# Altium schematic sheet MBoardConnect.SchDoc
size B; SheetNumber: 2; SheetTotal: 4
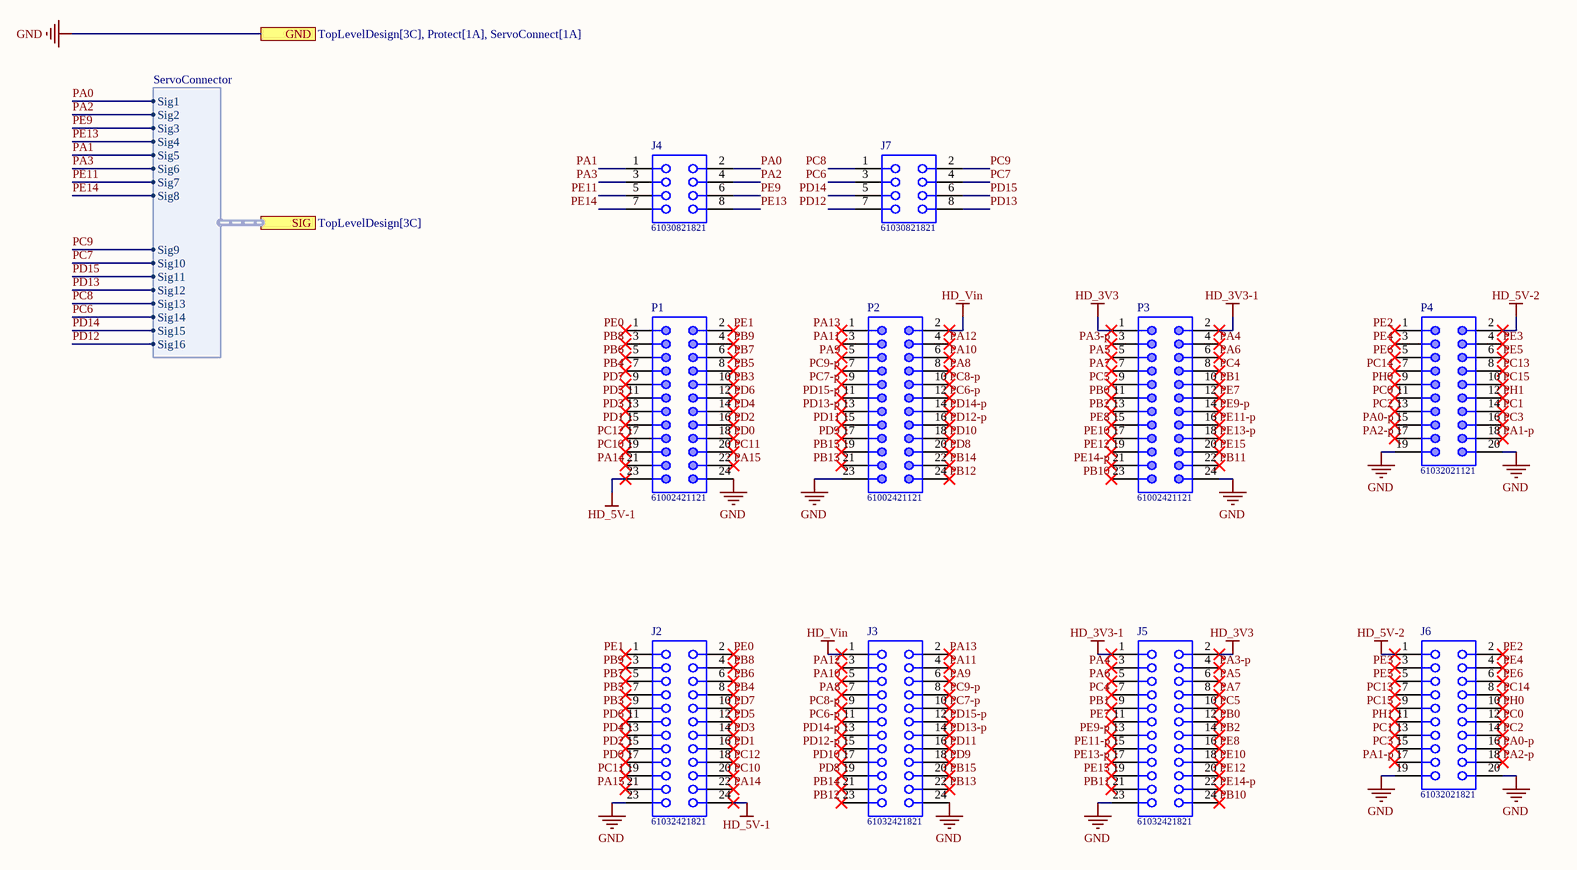
[diagram p0: MBoardConnect.SchDoc]

## Parts
J2  61032421821  [61032421821]
J3  61032421821  [61032421821]
J4  61030821821  [61030821821]
J5  61032421821  [61032421821]
J6  61032021821  [61032021821]
J7  61030821821  [61030821821]
P1  61002421121  [61002421121]
P2  61002421121  [61002421121]
P3  61002421121  [61002421121]
P4  61032021121  [61032021121]

## Ports
GND (see TopLevelDesign[3C], Protect[1A], ServoConnect[1A]), SIG (harness ServoConnector, see TopLevelDesign[3C])

## Harnesses
ServoConnector: Sig1, Sig2, Sig3, Sig4, Sig5, Sig6, Sig7, Sig8, Sig9, Sig10, Sig11, Sig12, Sig13, Sig14, Sig15, Sig16

## Nets
GND: J2.23 J3.24 J5.23 J6.19 J6.20 P1.24 P2.23 P3.24 P4.19 P4.20 ; port GND
HD_3V3: J5.2 P3.1
HD_3V3-1: J5.1 P3.2
HD_5V-1: J2.24 P1.23
HD_5V-2: J6.1 P4.2
HD_Vin: J3.1 P2.2
PA0: J4.2 ; port SIG.Sig1
PA0-p: J6.16 P4.15
PA1: J4.1 ; port SIG.Sig5
PA1-p: J6.17 P4.18
PA2: J4.4 ; port SIG.Sig2
PA2-p: J6.18 P4.17
PA3: J4.3 ; port SIG.Sig6
PA3-p: J5.4 P3.3
PA4: J5.3 P3.4
PA5: J5.6 P3.5
PA6: J5.5 P3.6
PA7: J5.8 P3.7
PA8: J3.7 P2.8
PA9: J3.6 P2.5
PA10: J3.5 P2.6
PA11: J3.4 P2.3
PA12: J3.3 P2.4
PA13: J3.2 P2.1
PA14: J2.22 P1.21
PA15: J2.21 P1.22
PB0: J5.12 P3.11
PB1: J5.9 P3.10
PB2: J5.14 P3.13
PB3: J2.9 P1.10
PB4: J2.8 P1.7
PB5: J2.7 P1.8
PB6: J2.6 P1.5
PB7: J2.5 P1.6
PB8: J2.4 P1.3
PB9: J2.3 P1.4
PB10: J5.24 P3.23
PB11: J5.21 P3.22
PB12: J3.23 P2.24
PB13: J3.22 P2.21
PB14: J3.21 P2.22
PB15: J3.20 P2.19
PC0: J6.12 P4.11
PC1: J6.13 P4.14
PC2: J6.14 P4.13
PC3: J6.15 P4.16
PC4: J5.7 P3.8
PC5: J5.10 P3.9
PC6: J7.3 ; port SIG.Sig14
PC6-p: J3.11 P2.12
PC7: J7.4 ; port SIG.Sig10
PC7-p: J3.10 P2.9
PC8: J7.1 ; port SIG.Sig13
PC8-p: J3.9 P2.10
PC9: J7.2 ; port SIG.Sig9
PC9-p: J3.8 P2.7
PC10: J2.20 P1.19
PC11: J2.19 P1.20
PC12: J2.18 P1.17
PC13: J6.7 P4.8
PC14: J6.8 P4.7
PC15: J6.9 P4.10
PD0: J2.17 P1.18
PD1: J2.16 P1.15
PD2: J2.15 P1.16
PD3: J2.14 P1.13
PD4: J2.13 P1.14
PD5: J2.12 P1.11
PD6: J2.11 P1.12
PD7: J2.10 P1.9
PD8: J3.19 P2.20
PD9: J3.18 P2.17
PD10: J3.17 P2.18
PD11: J3.16 P2.15
PD12: J7.7 ; port SIG.Sig16
PD12-p: J3.15 P2.16
PD13: J7.8 ; port SIG.Sig12
PD13-p: J3.14 P2.13
PD14: J7.5 ; port SIG.Sig15
PD14-p: J3.13 P2.14
PD15: J7.6 ; port SIG.Sig11
PD15-p: J3.12 P2.11
PE0: J2.2 P1.1
PE1: J2.1 P1.2
PE2: J6.2 P4.1
PE3: J6.3 P4.4
PE4: J6.4 P4.3
PE5: J6.5 P4.6
PE6: J6.6 P4.5
PE7: J5.11 P3.12
PE8: J5.16 P3.15
PE9: J4.6 ; port SIG.Sig3
PE9-p: J5.13 P3.14
PE10: J5.18 P3.17
PE11: J4.5 ; port SIG.Sig7
PE11-p: J5.15 P3.16
PE12: J5.20 P3.19
PE13: J4.8 ; port SIG.Sig4
PE13-p: J5.17 P3.18
PE14: J4.7 ; port SIG.Sig8
PE14-p: J5.22 P3.21
PE15: J5.19 P3.20
PH0: J6.10 P4.9
PH1: J6.11 P4.12

## Library data of the parts
J2 J3 J5 = CMP-002-00462-1: WR-PHD Socket Header, SMT, pitch 2.54mm, Dual Row, Vertical, 24p; Manufacturer: Wurth Elektronik; Pin Number: 24; Contact Resistance: 20mOhm; Rated Current: 3A; Working Voltage: 250VAC; Withstanding Voltage: 600VAC; System: Connector; Packaging: Tape and Reel; Supplier 3 Name: thegioiic; Operating Temperature: -40 to +105degC; Pitch: 2.54mm; Row Number: Dual; Orientation: Vertical; ComponentLink2URL: https://www.we-online.com/catalog/datasheet/61032421821.pdf; Mounting Technology: SMT; Component Type: Standard; Supplier 1 URL: https://www.mouser.vn/ProductDetail/Wurth-Elektronik/61032421821?qs=Cb2nCFKsA8olwuXV8WYPMw%3D%3D; Supplier 1 Name: Mouser; Pins: 24; Published Date: May 2020; ComponentLink1Description: Manufacturer; Supplier 2 Name: Digi-Key; Supplier 3 SN: N/A; ComponentLink4Description: Global Supply; ComponentLink2Description: Datasheet; Source: WR-PHD_Socket Header_2.54mm.SchLib; ComponentLink3URL: https://www.we-online.com/en/components/products/PHD_2_54_SMT_DUAL_SOCKET_HEADER_6100XX21821?sq=61032421821#61032421821; ComponentLink1URL: http://www.we-online.de; Supplier 2 URL: N/A; Gender: Socket Header; Manufacturer Part Number: 61032421821; Design Item ID: 61032421821; ComponentLink4URL: https://www.mouser.vn/ProductDetail/Wurth-Elektronik/61032421821?qs=Cb2nCFKsA8olwuXV8WYPMw%3D%3D; Supplier 2 SN: N/A; Supplier 3 URL: N/A; ComponentLink3Description: Global Supply; Supplier 1 SN: 710-61032421821
J4 J7 = CMP-002-00443-1: WR-PHD Socket Header, SMT, pitch 2.54mm, Dual Row, Vertical, 8p; Manufacturer: Wurth Elektronik; Pin Number: 8; Contact Resistance: 20mOhm; Working Voltage: 250VAC; Withstanding Voltage: 600VAC; Rated Current: 3A; System: Connector; Source: WR-PHD_Socket Header_2.54mm.SchLib; Manufacturer Part Number: 61030821821; Supplier 2 URL: N/A; Mounting Technology: SMT; Supplier 2 Name: Digi-Key; Supplier 3 Name: thegioiic; Supplier 3 SN: N/A; ComponentLink4Description: Global Supply; Supplier 1 SN: 710-61030821821; Component Type: Standard; Published Date: May 2020; Supplier 3 URL: N/A; Packaging: Tape and Reel; Orientation: Vertical; Supplier 2 SN: N/A; ComponentLink3URL: https://www.we-online.com/en/components/products/PHD_2_54_SMT_DUAL_SOCKET_HEADER_6100XX21821?sq=61030821821#61030821821; Operating Temperature: -40 to +105degC; Supplier 1 Name: Mouser; ComponentLink2Description: Datasheet; Row Number: Dual; Pins: 8; Design Item ID: 61030821821; ComponentLink3Description: Global Supply; Supplier 1 URL: https://www.mouser.vn/ProductDetail/Wurth-Elektronik/61030821821?qs=Cb2nCFKsA8oJEHHhLPQ3%2Fg%3D%3D; ComponentLink2URL: https://www.we-online.com/catalog/datasheet/61030821821.pdf; ComponentLink4URL: https://www.mouser.vn/ProductDetail/Wurth-Elektronik/61030821821?qs=Cb2nCFKsA8oJEHHhLPQ3%2Fg%3D%3D; Gender: Socket Header; ComponentLink1URL: http://www.we-online.de; Pitch: 2.54mm; ComponentLink1Description: Manufacturer
J6 = CMP-002-00459-1: WR-PHD Socket Header, SMT, pitch 2.54mm, Dual Row, Vertical, 20p; Manufacturer: Wurth Elektronik; Working Voltage: 250VAC; Pin Number: 20; Withstanding Voltage: 600VAC; Contact Resistance: 20mOhm; Rated Current: 3A; System: Connector; ComponentLink1URL: http://www.we-online.de; ComponentLink4URL: https://www.mouser.vn/ProductDetail/Wurth-Elektronik/61032021821?qs=Cb2nCFKsA8rLJ0ZbRtJw1w%3D%3D; Operating Temperature: -40 to +105degC; ComponentLink3URL: https://www.we-online.com/en/components/products/PHD_2_54_SMT_DUAL_SOCKET_HEADER_6100XX21821?sq=61032021821#61032021821; Orientation: Vertical; ComponentLink2Description: Datasheet; Supplier 1 SN: 710-61032021821; ComponentLink2URL: https://www.we-online.com/catalog/datasheet/61032021821.pdf; Row Number: Dual; Packaging: Tape and Reel; Supplier 1 URL: https://www.mouser.vn/ProductDetail/Wurth-Elektronik/61032021821?qs=Cb2nCFKsA8rLJ0ZbRtJw1w%3D%3D; Supplier 2 URL: N/A; Source: WR-PHD_Socket Header_2.54mm.SchLib; ComponentLink1Description: Manufacturer; Manufacturer Part Number: 61032021821; ComponentLink3Description: Global Supply; Component Type: Standard; Supplier 1 Name: Mouser; Gender: Socket Header; Supplier 3 Name: thegioiic; Supplier 3 URL: N/A; Mounting Technology: SMT; Supplier 3 SN: N/A; Pitch: 2.54mm; Pins: 20; Supplier 2 Name: Digi-Key; ComponentLink4Description: Global Supply; Supplier 2 SN: N/A; Published Date: May 2020; Design Item ID: 61032021821
P1-P3 = CMP-002-00395-1: WR-PHD Pin Header, SMT, pitch 2.54mm, Dual Row, Vertical, 24p; Manufacturer: Wurth Elektronik; Withstanding Voltage: 500VAC; Pin Number: 24; Rated Current: 3A; Working Voltage: 250VAC; Supply name 1: Mouser; Contact Resistance: 20mOhm; System: Connector; Supplier 1 SN: 710-61002421121; Supplier 3 URL: N/A; ComponentLink3Description: Global Supply; Orientation: Vertical; Packaging: Tube; Published Date: May 2020; Pins: 24; Supplier 2 SN: N/A; Component Type: Standard; Source: WR-PHD_Pin Header_2.54mm.SchLib; Supplier 3 Name: thegioiic; Design Item ID: 61002421121; Mounting Technology: SMT; ComponentLink4Description: Global Supply; Row Number: Dual; ComponentLink1URL: http://www.we-online.de; ComponentLink2URL: https://www.we-online.com/catalog/datasheet/61002421121.pdf; ComponentLink2Description: Datasheet; ComponentLink4URL: https://www.mouser.vn/ProductDetail/Wurth-Elektronik/61002421121?qs=PhR8RmCirEaUrVIpVd3oMg%3D%3D; Supplier 1 Name: Mouser; Gender: Pin Header; Supplier 2 URL: N/A; ComponentLink3URL: https://www.we-online.com/en/components/products/PHD_2_54_SMT_DUAL_PIN_HEADER_6100XX21121?sq=61002421121#61002421121; Pitch: 2.54mm; ComponentLink1Description: Manufacturer; Supplier 1 URL: https://www.mouser.vn/ProductDetail/Wurth-Elektronik/61002421121?qs=PhR8RmCirEaUrVIpVd3oMg%3D%3D; Operating Temperature: -40 to +125degC; Supplier 3 SN: N/A; Supplier 2 Name: Digi-Key; Manufacturer Part Number: 61002421121
P4 = CMP-002-00458-1: WR-PHD Pin Header, SMT, pitch 2.54mm, Dual Row, Vertical, 20p; Manufacturer: Wurth Elektronik; Withstanding Voltage: 500VAC; Contact Resistance: 20mOhm; Working Voltage: 250VAC; Pin Number: 20; Rated Current: 3A; Supply name 1: Mouser; System: Connector; Supplier 2 Name: Digi-Key; Packaging: Tape and Reel; Mounting Technology: SMT; Supplier 3 SN: N/A; Published Date: May 2020; Pins: 20; Component Type: Standard; ComponentLink3URL: https://www.we-online.com/en/components/products/PHD_2_54_SMT_DUAL_PIN_HEADER_6100XX21121?sq=61032021121#61032021121; Manufacturer Part Number: 61032021121; Pitch: 2.54mm; ComponentLink2URL: https://www.we-online.com/catalog/datasheet/61032021121.pdf; ComponentLink1Description: Manufacturer; Operating Temperature: -40 to +125degC; Source: WR-PHD_Pin Header_2.54mm.SchLib; ComponentLink1URL: http://www.we-online.de; ComponentLink4Description: Global Supply; Supplier 1 SN: 710-61032021121; ComponentLink3Description: Global Supply; Supplier 3 URL: N/A; Supplier 2 SN: N/A; Row Number: Dual; Supplier 3 Name: thegioiic; ComponentLink4URL: https://www.mouser.vn/ProductDetail/Wurth-Elektronik/61032021121?qs=PhR8RmCirEazLxlZVVgCjg%3D%3D; Supplier 1 Name: Mouser; Orientation: Vertical; ComponentLink2Description: Datasheet; Design Item ID: 61032021121; Supplier 1 URL: https://www.mouser.vn/ProductDetail/Wurth-Elektronik/61032021121?qs=PhR8RmCirEazLxlZVVgCjg%3D%3D; Gender: Pin Header; Supplier 2 URL: N/A